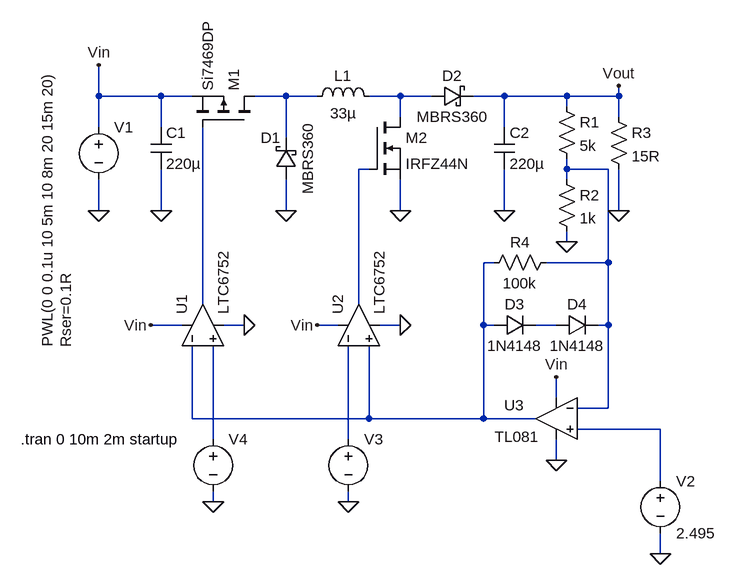
[diagram p0: schematic Regulador Buck-Boost.asc]
Regulador Buck-Boost.asc, the LTspice schematic file:
Version 4
SHEET 1 1112 792
WIRE 48 48 48 0
WIRE 144 48 48 48
WIRE 192 48 144 48
WIRE 336 48 288 48
WIRE 384 48 336 48
WIRE 512 48 464 48
WIRE 560 48 512 48
WIRE 672 48 624 48
WIRE 768 48 672 48
WIRE 848 48 848 32
WIRE 848 48 768 48
WIRE 768 64 768 48
WIRE 512 80 512 48
WIRE 848 80 848 48
WIRE 48 96 48 48
WIRE 144 96 144 48
WIRE 672 96 672 48
WIRE 336 112 336 48
WIRE 464 160 448 160
WIRE 768 160 768 144
WIRE 832 160 768 160
WIRE 768 176 768 160
WIRE 48 224 48 176
WIRE 144 224 144 160
WIRE 336 224 336 176
WIRE 512 224 512 176
WIRE 672 224 672 160
WIRE 848 224 848 160
WIRE 768 272 768 256
WIRE 656 304 640 304
WIRE 832 304 832 160
WIRE 832 304 736 304
WIRE 208 368 208 96
WIRE 448 368 448 160
WIRE 176 400 128 400
WIRE 272 400 240 400
WIRE 416 400 384 400
WIRE 512 400 480 400
WIRE 640 400 640 304
WIRE 656 400 640 400
WIRE 752 400 720 400
WIRE 832 400 832 304
WIRE 832 400 816 400
WIRE 752 512 752 480
WIRE 832 528 832 400
WIRE 832 528 784 528
WIRE 192 544 192 432
WIRE 464 544 464 432
WIRE 464 544 192 544
WIRE 640 544 640 400
WIRE 640 544 464 544
WIRE 720 544 640 544
WIRE 912 560 784 560
WIRE 224 576 224 432
WIRE 432 576 432 432
WIRE 752 608 752 576
WIRE 912 640 912 560
WIRE 224 672 224 656
WIRE 432 672 432 656
WIRE 912 752 912 720
FLAG 48 224 0
FLAG 144 224 0
FLAG 336 224 0
FLAG 512 224 0
FLAG 672 224 0
FLAG 848 224 0
FLAG 768 272 0
FLAG 48 0 Vin
FLAG 128 400 Vin
FLAG 384 400 Vin
FLAG 272 400 0
FLAG 512 400 0
FLAG 752 480 Vin
FLAG 752 608 0
FLAG 912 752 0
FLAG 224 672 0
FLAG 432 672 0
FLAG 848 32 Vout
SYMBOL voltage 48 80 R0
WINDOW 3 -79 354 VLeft 2
WINDOW 123 0 0 Left 0
WINDOW 39 -51 354 VLeft 2
SYMATTR Value PWL(0 0 0.1u 10 5m 10 8m 20 15m 20)
SYMATTR SpiceLine Rser=0.1R
SYMATTR InstName V1
SYMBOL cap 128 96 R0
SYMATTR InstName C1
SYMATTR Value 220µ
SYMATTR SpiceLine Rser=25m
SYMBOL pmos 288 96 M270
SYMATTR InstName M1
SYMATTR Value Si7469DP
SYMBOL ind 368 64 R270
WINDOW 0 32 56 VTop 2
WINDOW 3 5 56 VBottom 2
SYMATTR InstName L1
SYMATTR Value 33µ
SYMATTR SpiceLine Rser=50m
SYMBOL schottky 352 176 R180
WINDOW 0 24 64 Left 2
WINDOW 3 -18 -23 VRight 2
SYMATTR InstName D1
SYMATTR Value MBRS360
SYMATTR Description Diode
SYMATTR Type diode
SYMBOL nmos 464 80 R0
SYMATTR InstName M2
SYMATTR Value IRFZ44N
SYMBOL schottky 560 64 R270
WINDOW 0 32 32 VTop 2
WINDOW 3 0 32 VBottom 2
SYMATTR InstName D2
SYMATTR Value MBRS360
SYMATTR Description Diode
SYMATTR Type diode
SYMBOL cap 656 96 R0
SYMATTR InstName C2
SYMATTR Value 220µ
SYMATTR SpiceLine Rser=25m
SYMBOL res 752 48 R0
SYMATTR InstName R1
SYMATTR Value 5k
SYMBOL res 752 160 R0
SYMATTR InstName R2
SYMATTR Value 1k
SYMBOL res 832 64 R0
SYMATTR InstName R3
SYMATTR Value 15R
SYMBOL Comparators\\LTC6752 144 400 R270
SYMATTR InstName U1
SYMBOL Comparators\\LTC6752 384 400 R270
SYMATTR InstName U2
SYMBOL voltage 912 624 R0
WINDOW 123 0 0 Left 0
WINDOW 39 0 0 Left 0
SYMATTR InstName V2
SYMATTR Value 2.495
SYMBOL voltage 224 560 R0
WINDOW 3 24 96 Invisible 2
WINDOW 123 0 0 Left 0
WINDOW 39 0 0 Left 0
SYMATTR Value PULSE(2 3 0 5u 5u 0 10u)
SYMATTR InstName V4
SYMBOL voltage 432 560 R0
WINDOW 3 24 96 Invisible 2
WINDOW 123 0 0 Left 0
WINDOW 39 0 0 Left 0
SYMATTR Value PULSE(3 4 0 5u 5u 0 10u)
SYMATTR InstName V3
SYMBOL diode 656 416 R270
WINDOW 0 32 32 VTop 2
WINDOW 3 0 32 VBottom 2
SYMATTR InstName D3
SYMATTR Value 1N4148
SYMBOL diode 752 416 R270
WINDOW 0 32 32 VTop 2
WINDOW 3 0 32 VBottom 2
SYMATTR InstName D4
SYMATTR Value 1N4148
SYMBOL res 752 288 R90
WINDOW 0 0 56 VBottom 2
WINDOW 3 32 56 VTop 2
SYMATTR InstName R4
SYMATTR Value 100k
SYMBOL AutoGenerated\\TL081 752 544 M0
WINDOW 0 65 -5 Bottom 2
WINDOW 3 60 12 Top 2
SYMATTR InstName U3
TEXT -72 576 Left 2 !.tran 0 10m 2m startup

The netlist it stands for:
* Regulador Buck-Boost.asc
V1 Vin 0 PWL(0 0 0.1u 10 5m 10 8m 20 15m 20) Rser=0.1R
C1 Vin 0 220µ Rser=25m
M1 N001 N006 Vin Vin Si7469DP
L1 N001 N002 33µ Rser=50m
D1 0 N001 MBRS360
M2 N002 N003 0 0 IRFZ44N
D2 N002 Vout MBRS360
C2 Vout 0 220µ Rser=25m
R1 Vout N004 5k
R2 N004 0 1k
R3 Vout 0 15R
XU1 N009 N005 Vin 0 N006 LTC6752  ; pins In+ In- V+ V- OUT
XU2 N005 N010 Vin 0 N003 LTC6752  ; pins In+ In- V+ V- OUT
V2 N008 0 2.495
V4 N009 0 PULSE(2 3 0 5u 5u 0 10u)
V3 N010 0 PULSE(3 4 0 5u 5u 0 10u)
D3 N005 N007 1N4148
D4 N007 N004 1N4148
R4 N004 N005 100k
* U3: TL081 (symbol AutoGenerated\TL081 not available, pins judged from their places): In+=N008 In-=N004 V+=Vin V-=0 OUT=N005
.model D D
.lib standard.dio
.model NMOS NMOS
.model PMOS PMOS
.lib standard.mos
.tran 0 10m 2m startup
.lib LTC7.lib
.backanno
.end